# EAGLE design tinytouchbutton_v2_0.2 (EAGLE 6.3)
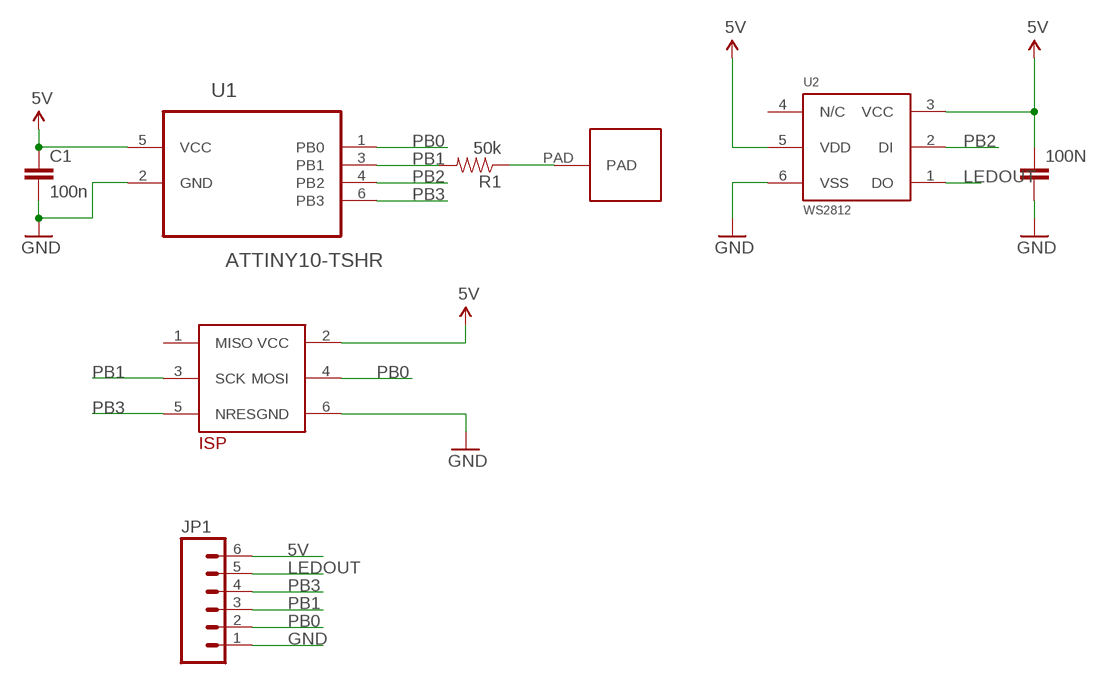
[diagram p0: schematic, sheet 1]

## Parts
100N  CAP0805  [0805]
C1  100n  CAP0805  [0805]
JP1  M06SIP  [1X06]
R1  50k  RESISTOR0805-RES  [0805]
U1  ATTINY10-TSHR  [SOT95P280X145-6N]
U2  WS2812  [PLCC6]
U$1  TB_ISPEDGE_2X3  [ISP_EDGE2X3]
U$2  TB_TOUCH_0.5INCH  [TOUCH_ROUND0.5INCH]

## Nets
5V [Power]: 100N.1 C1.1 JP1.6 U1.5(VCC) U2.3(VCC) U2.5(VDD) U$1.2(VCC)
GND [Power]: 100N.2 C1.2 JP1.1 U1.2(GND) U2.6(VSS) U$1.6(GND)
LEDOUT: JP1.5 U2.1(DO)
PAD: R1.1 U$2.PAD
PB0: JP1.2 U1.1(PB0) U$1.4(MOSI)
PB1: JP1.3 R1.2 U1.3(PB1) U$1.3(SCK)
PB2: U1.4(PB2) U2.2(DI)
PB3: JP1.4 U1.6(PB3) U$1.5(NRES)
Unconnected: U2.4(N/C) U$1.1(MISO)

## Library data of the parts
100N C1 = SparkFun-Capacitors:CAP: Capacitor Standard 0603 ceramic capacitor, and 0.1" leaded capacitor.
JP1 = SparkFun-Connectors:M06: Header 6 Standard 6-pin 0.1" header. Use with straight break away headers (SKU : PRT-00116), right angle break away headers (PRT-00553), swiss pins (PRT-00743), machine pins (PRT-00117), and female headers (PRT-00115). Molex polarized connector foot print use with SKU : PRT-08094 with associated crimp pins and housings. NOTES ON THE VARIANTS LOCK and LOCK_LONGPADS... This footprint was designed to help hold the alignment of a through-hole component (i.e. 6-pin header) while soldering it into place. You may notice that each hole has been shifted either up or down by 0.005 of an inch from it's more standard position (which is a perfectly straight line). This slight alteration caused the pins (the squares in the middle) to touch the edges of the holes. Because they are alternating, it causes a "brace" to hold the component in place. 0.005 has proven to be the perfect amount of "off-center" position when using our standard breakaway headers. Although looks a little odd when you look at the bare footprint, once you have a header in there, the alteration is very hard to notice. Also, if you push a header all the way into place, it is covered up entirely on the bottom side. This idea of altering the position of holes to aid alignment will be further integrated into the Sparkfun Library for other footprints. It can help hold any component with 3 or more connection pins.
R1 = SparkFun-Resistors:RESISTOR: Resistor Basic schematic elements and footprints for 0603, 1206, and PTH resistors.
U1 = Atmel_By_element14_Batch_1:ATTINY10-TSHR: 8-bit Microcontroller with In-System Programmable Flash; MPN: ATTINY10-TSHR; OC_FARNELL: 1748538; OC_NEWARK: 26R5645; PACKAGE: SOT-23-6; SUPPLIER: Atmel
U2 = WS2812:WS2812: WS2812 Intelligent RGB LED
U$1 = tb_custom:TB_ISPEDGE_2X3: AVR-ISP connector an Platinenrand
U$2 = tb_custom:TB_TOUCH_0.5INCH

## Board
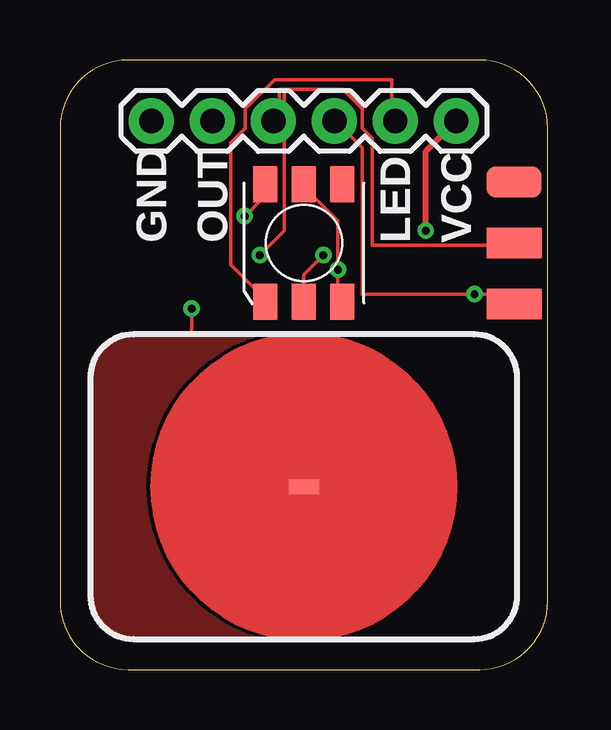
[diagram p1: board, top side]
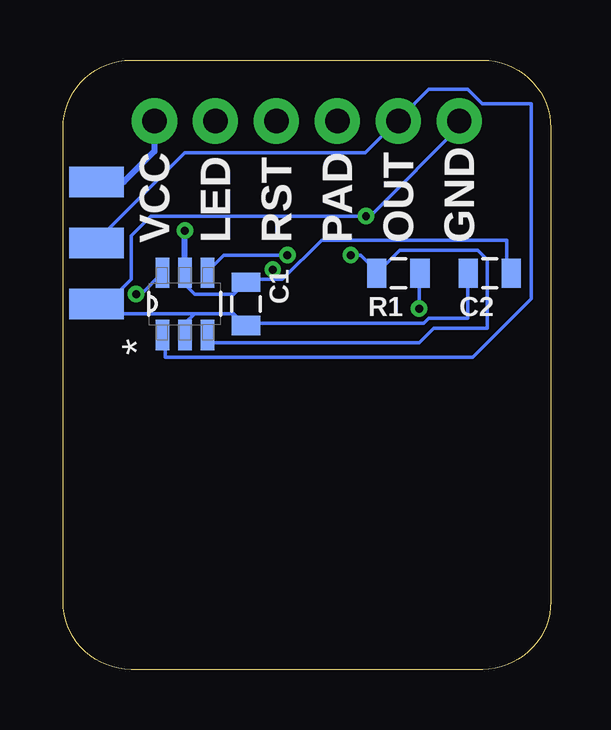
[diagram p2: board, bottom side, seen from below]

Size 20.32 x 25.4 mm. Coordinates in mm from the lower left corner, seen from the top.
Outline: 0,22.56 0,2.84 arc90 2.84,0 17.48,0 arc90 20.32,2.84 20.32,22.56 arc90 17.48,25.4 2.84,25.4 arc90 0,22.56
Copper layers (1*16): Top 0.0356mm / dielectric 1.5011mm / Bottom 0.0356mm
Design rules "LaenPCBOrder": minimum track width 6mil, minimum drill 13mil, track to track 6mil, track to pad 6mil, pad to pad 6mil, via to via 6mil, smd to smd 6mil, copper to edge 15mil, drill to drill 6mil, minimum pad ring 7mil, minimum via ring 7mil, stop-mask expansion 4mil, vias tented up to drill 0mil, thermal gap 10mil

### Footprints (pad centres in the part's own frame; a part is rotated, then mirrored left to right if it is on the bottom)
0805 = smd 0.8 x 1.2: 1 -0.9,0; 2 0.9,0
1X06 = drill 1.016 pad 1.88: 1 0,0; 2 2.54,0; 3 5.08,0; 4 7.62,0; 5 10.16,0; 6 12.7,0
SOT95P280X145-6N = smd 1.27 x 0.559: 1 -1.295,0.94; 2 -1.295,0; 3 -1.295,-0.94; 4 1.295,-0.94; 5 1.295,0; 6 1.295,0.94
PLCC6 = smd 1.5 x 1: 1 2.45,-1.6; 2 2.45,0; 3 2.45,1.6; 4 -2.45,1.6; 5 -2.45,0; 6 -2.45,-1.6
ISP_EDGE2X3 = smd 2.286 x 1.27: 1 -0.127,2.54; 3 -0.127,0; 5 -0.127,-2.54 | smd 2.286 x 1.27 bottom: 2 -0.127,2.54; 4 -0.127,0; 6 -0.127,-2.54
TOUCH_ROUND0.5INCH = smd 1.27 x 0.635: PAD 0,0

### Placement (x,y rotation side)
100N  2.54,16.51 180 bottom
C1  12.7,15.24 270 bottom
JP1  3.81,22.86 0 top
R1  6.35,16.51 180 bottom
U1  15.24,15.24 90 bottom
U2  10.16,17.78 270 top
U$1  19.05,17.78 0 top
U$2  10.16,7.62 0 top

### Tracks (layer width: path | path; a pad name or v marks a point on that pad's centre or on a via)
5V  (via drill 0.33)
  Top 0.152: U2.5 10.16,20.12 11.58,18.69 v11.58,16.66 11.58,15.44 U2.3
  Top 0.254: v15.24,18.29 15.24,21.59 JP1.6
  Bottom 0.152: 18.9,20.32 U$1.2 | 16.46,22.76 JP1.6 | 11.58,16.26 12.6,16.26 C1.1 12.8,16.05 13.21,15.65 14.83,15.65 15.24,16.05 U1.5 15.24,17.07 | 11.58,16.26 11.18,16.26 9.55,17.88 1.83,17.88 1.83,16.66 100N.1 | 11.58,16.26 v11.58,16.66
  Bottom 0.254: 15.24,17.07 v15.24,18.29 | JP1.6 16.51,21.59 17.78,20.32 U$1.2
GND  (via drill 0.33)
  Top 0.152: 8.33,19.91 8.53,20.12 U2.6 8.33,19.91 | 8.33,19.91 8.33,19.51 7.72,18.9 v7.7,18.9
  Bottom 0.152: 4.47,22.76 3.86,22.76 JP1.1 3.66,22.76 7.52,18.9 v7.7,18.9 16.66,18.9 17.48,18.09 17.48,16.26 18.69,15.04 | 14.83,14.83 13.21,14.83 12.8,14.43 C1.2 12.6,14.43 5.28,14.43 5.08,14.63 3.45,14.63 3.45,16.46 100N.2 | 14.83,14.83 15.24,14.43 U1.2 | 18.69,15.04 18.49,14.83 14.83,14.83 | 18.69,15.04 18.9,15.24 U$1.6 18.69,15.04
LEDOUT
  Top 0.152: JP1.5 13.82,22.96 13.82,24.59 8.94,24.59 7.72,23.37 7.72,22.55 7.11,21.95 7.11,16.87 8.53,15.44 U2.1
PAD  (via drill 0.33)
  Top 0.152: 5.49,13.97 v5.49,15.04
  Bottom 0.152: v5.49,15.04 5.49,16.46 R1.1
  pour Top: 17.25,1.27 3.07,1.27 arc-90 1.27,3.07 1.27,12.17 arc-90 3.07,13.97 17.25,13.97 arc-90 19.05,12.17 19.05,3.07 arc-90
PB0
  Bottom 0.152: U1.1 16.05,13.82 16.05,13.01 3.25,13.01 0.81,15.44 0.81,23.57 2.85,23.57 3.45,24.18 5.08,24.18 6.3,22.96 JP1.2 6.5,22.76 7.72,21.54 15.24,21.54 18.9,17.88 U$1.4
PB1  (via drill 0.33)
  Top 0.152: 9.35,24.18 9.14,24.18 9.14,23.16 8.94,22.96 JP1.3 | 9.35,24.18 11.79,24.18 12.6,23.37 12.6,22.55 13.01,22.15 13.01,17.68 18.9,17.68 U$1.3 | v8.33,17.27 9.35,18.29 9.35,24.18
  Bottom 0.152: U1.3 14.22,13.82 14.02,13.61 5.49,13.61 4.88,14.22 2.64,14.22 2.64,17.07 3.05,17.48 6.3,17.48 7.11,16.66 R1.2 7.32,16.66 7.92,17.27 v8.33,17.27
PB2  (via drill 0.33)
  Top 0.152: v10.97,17.27 10.16,16.46 U2.2
  Bottom 0.152: v10.97,17.27 13.61,17.27 14.22,16.66 U1.4
PB3  (via drill 0.33)
  Top 0.152: U$1.5 18.9,15.24 18.9,15.65 v17.27,15.65 12.6,15.65 12.6,21.74 11.58,22.76 JP1.4
  Bottom 0.152: U1.6 17.07,15.65 v17.27,15.65

### Text on the board
tPlace: GND | OUT | LED | LED | VCC | VCC
bPlace: GND | OUT | PAD | RST | LED | VCC | C2 | R1 | C1